# Altium schematic sheet 24Vto48V.SchDoc
size A
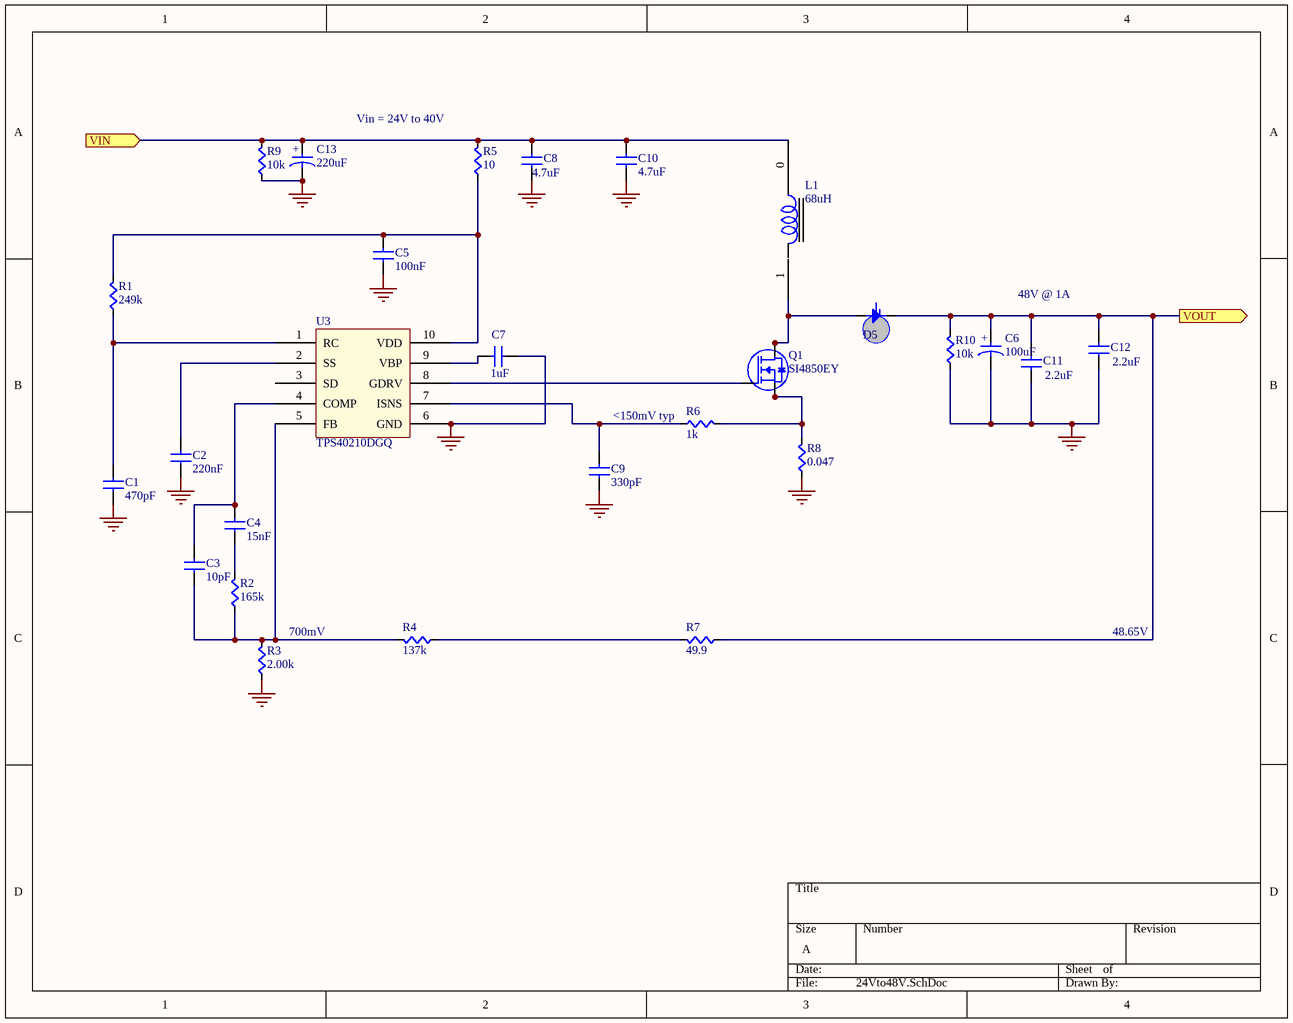
[diagram p0: 24Vto48V.SchDoc]

## Parts
C1  value 470pF  [CAPC0603]  (hidden comment: Cap)
C2  value 220nF  [CAPC0603]  (hidden comment: Cap)
C3  value 10pF  [CAPC0603]  (hidden comment: Cap)
C4  value 15nF  [CAPC0603]  (hidden comment: Cap)
C5  value 100nF  [CAPC0603]  (hidden comment: Cap)
C6  value 100uF  [PCE3917CT-ND]  (hidden comment: Cap Tant)
C7  value 1uF  [CAPC0603]  (hidden comment: Cap)
C8  value 4.7uF  [CAP1210]  (hidden comment: CAP1210)
C9  value 330pF  [CAPC0603]  (hidden comment: Cap)
C10  value 4.7uF  [CAP1210]  (hidden comment: CAP1210)
C11  value 2.2uF  [CAP1210]  (hidden comment: CAP1210)
C12  value 2.2uF  [CAP1210]  (hidden comment: CAP1210)
C13  value 220uF  [PCE3921CT-ND]  (hidden comment: Cap Tant)
D5  Diode  [MBRS360SMB]  (value not drawn)
L1  value 68uH  [732-1247-1-ND]  (hidden comment: 37392C)
Q1  SI4850EY  [SOIC-8-NO-EP]
R1  value 249k  [RES0603]  (hidden comment: Res)
R2  value 165k  [RES0603]  (hidden comment: Res)
R3  value 2.00k  [RES0603]  (hidden comment: Res)
R4  value 137k  [RES0603]  (hidden comment: Res)
R5  value 10  [RES0603]  (hidden comment: Res)
R6  value 1k  [RES0603]  (hidden comment: Res)
R7  value 49.9  [RES0603]  (hidden comment: Res)
R8  value 0.047  [RES2512]  (hidden comment: Res)
R9  value 10k  [RES0603]  (hidden comment: Res)
R10  value 10k  [RES0603]  (hidden comment: Res)
U3  TPS40210DGQ  [TPS40210]

## Ports
VIN (in), VOUT (out)

## Nets
GND: C1.2(B) C2.2(B) C5.2(B) C6.2(B) C7.2(B) C8.2(B) C9.2(B) C10.2(B) C11.2(B) C12.2(B) C13.2(B) R3.2(B) R8.2(B) R9.2(B) R10.2(B) U3.6(GND)
VIN: C8.1(A) C10.1(A) C13.1(A) L1.0 R5.1(A) R9.1(A) ; port VIN
VOUT: C6.1(A) C11.1(A) C12.1(A) D5.C R7.2(B) R10.1(A) ; port VOUT
NetC1_1: C1.1(A) R1.2(B) U3.1(RC)
NetC2_1: C2.1(A) U3.2(SS)
NetC3_1: C3.1(A) C4.1(A) U3.4(COMP)
NetC3_2: C3.2(B) R2.2(B) R3.1(A) R4.1(A) U3.5(FB)
NetC4_2: C4.2(B) R2.1(A)
NetC5_1: C5.1(A) R1.1(A) R5.2(B) U3.10(VDD)
NetC7_1: C7.1(A) U3.9(VBP)
NetC9_1: C9.1(A) R6.2(B) U3.7(ISNS)
NetD5_A: D5.A L1.1 Q1.5(D) Q1.6(D) Q1.7(D) Q1.8(D)
NetQ1_1: Q1.1(S) Q1.2(S) Q1.3(S) R6.1(A) R8.1(A)
NetQ1_4: Q1.4(G) U3.8(GDRV)
NetR4_2: R4.2(B) R7.1(A)

Not connected (* = marked no-connect by the designer): U3 3(SD)

## Notes on the sheet
- (near R5) Vin = 24V to 40V
- 48V @ 1A
- (near R6) <150mV typ
- (near R3) 700mV
- 48.65V
- (in symbol CapPol) +

## Library data of the parts
C6 = CapPol: CAP ALUM 100UF 20% 50V SMD; Supplier 1: Digi-Key; Supplier Part Number 1: PCE3917CT-ND
C8 C10-C12 = CAP1210: CAP CER 10UF 50V 20% X5R 1210; Supplier 1: Digi-Key
  C8 C10: Supplier Part Number 1: 1276-1292-1-ND
  C11 C12: Supplier Part Number 1: 445-4498-1-ND
C13 = CapPol: CAP ALUM 220UF 20% 50V SMD; Supplier 1: Digi-Key; Supplier Part Number 1: 399-6123-ND
D5 = Diode: Standard Diode Template; Value: 60V 3A; Supplier Part Number 1: MBRS360BT3GOSCT-ND; Supplier: Digi-Key
L1 = 37392C: INDUCTOR 3.90UH 10.0A SMD; Supplier 1: Digi-Key; Supplier Part Number 1: 732-1247-1-ND
Q1 = SI4850EY: MOSFET N-CH 60V 6A 8-SOIC; Supplier 1: Digi-Key; Supplier Part Number 1: SI4850EY-T1-E3CT-ND
C1-C5 C7 C9 = Cap: Supplier 1: Digi-Key
  C1: Supplier Part Number 1: 399-7919-1-ND
  C2: Supplier Part Number 1: 445-1318-1-ND
  C3: Supplier Part Number 1: 490-3570-1-ND
  C4: Supplier Part Number 1: 1276-1967-1-ND
  C5: Supplier Part Number 1: 311-1343-1-ND
  C7: Supplier Part Number 1: 311-1446-1-ND
  C9: Supplier Part Number 1: 1276-6658-1-ND
R1-R10 = Res: Supplier 1: Digi-Key
  R1: Supplier Part Number 1: A102243CT-ND
  R2: Supplier Part Number 1: 311-165KHRCT-ND
  R3: Supplier Part Number 1: 311-2.00KHRCT-ND
  R4: Supplier Part Number 1: 311-137KHRCT-ND
  R5: Supplier Part Number 1: 311-10.0HRCT-ND
  R6: Supplier Part Number 1: A102226CT-ND
  R7: Supplier Part Number 1: A102283CT-ND
  R8: Supplier Part Number 1: P47TCT-ND
  R9 R10: Supplier Part Number 1: RMCF0603FT10K0CT-ND
U3 = TPS40210DGQ: Supplier Part Number 1: 296-26969-1-ND; Supplier 1: Digi-Key